# EAGLE schematic sparta_rev2 (EAGLE 6.5.0)
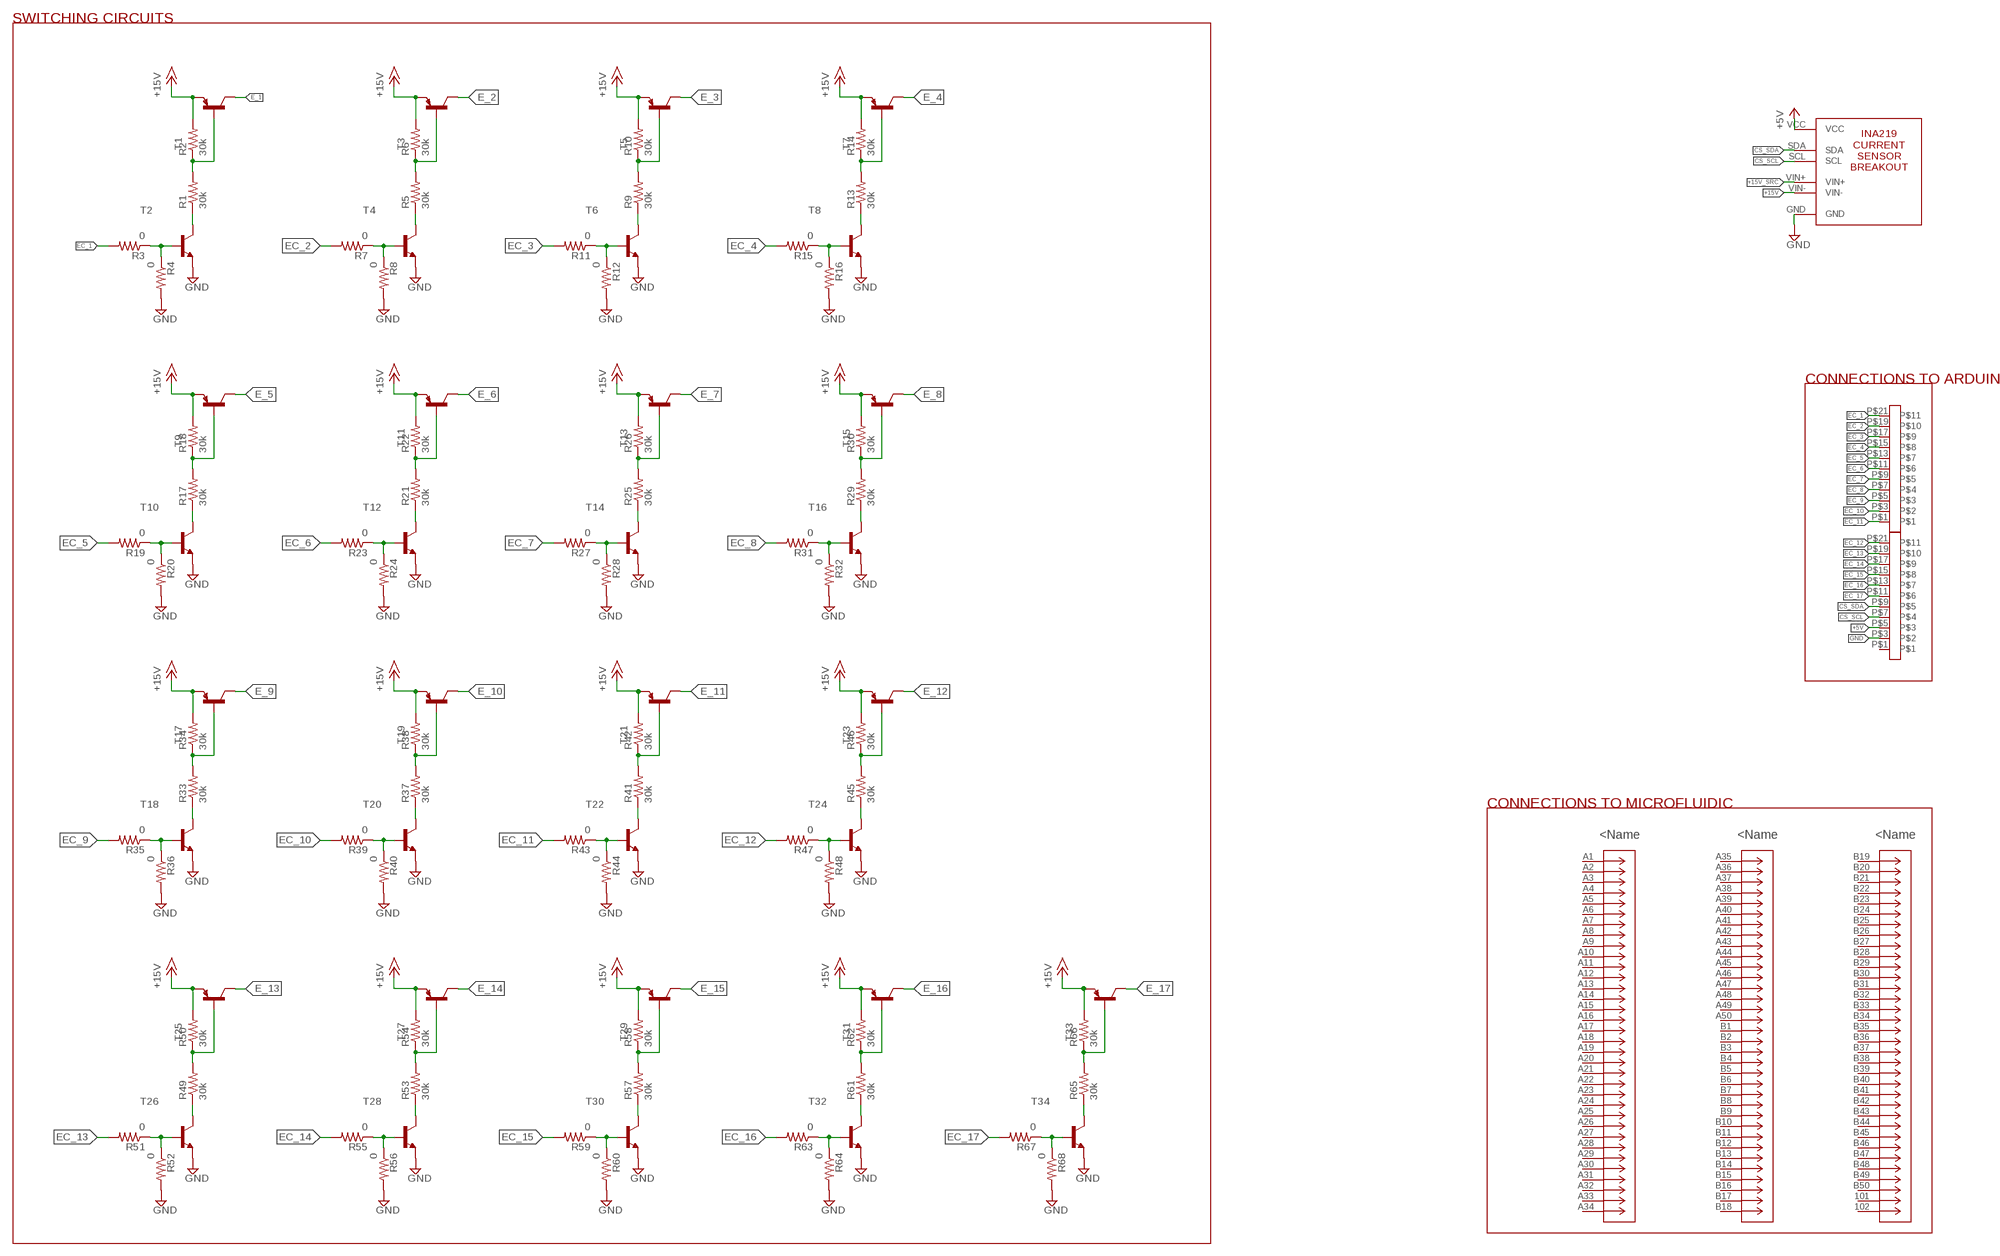
[diagram p0: schematic, sheet 1]

## Parts
J1  FX2-100P-1.27SV(71)  [CON100_2X50_UTZF_FX2C]
R1  30k  R-US_0207/10  [0207/10]
R2  30k  R-US_0207/10  [0207/10]
R3  0  R-US_0207/10  [0207/10]
R4  0  R-US_0207/10  [0207/10]
R5  30k  R-US_0207/10  [0207/10]
R6  30k  R-US_0207/10  [0207/10]
R7  0  R-US_0207/10  [0207/10]
R8  0  R-US_0207/10  [0207/10]
R9  30k  R-US_0207/10  [0207/10]
R10  30k  R-US_0207/10  [0207/10]
R11  0  R-US_0207/10  [0207/10]
R12  0  R-US_0207/10  [0207/10]
R13  30k  R-US_0207/10  [0207/10]
R14  30k  R-US_0207/10  [0207/10]
R15  0  R-US_0207/10  [0207/10]
R16  0  R-US_0207/10  [0207/10]
R17  30k  R-US_0207/10  [0207/10]
R18  30k  R-US_0207/10  [0207/10]
R19  0  R-US_0207/10  [0207/10]
R20  0  R-US_0207/10  [0207/10]
R21  30k  R-US_0207/10  [0207/10]
R22  30k  R-US_0207/10  [0207/10]
R23  0  R-US_0207/10  [0207/10]
R24  0  R-US_0207/10  [0207/10]
R25  30k  R-US_0207/10  [0207/10]
R26  30k  R-US_0207/10  [0207/10]
R27  0  R-US_0207/10  [0207/10]
R28  0  R-US_0207/10  [0207/10]
R29  30k  R-US_0207/10  [0207/10]
R30  30k  R-US_0207/10  [0207/10]
R31  0  R-US_0207/10  [0207/10]
R32  0  R-US_0207/10  [0207/10]
R33  30k  R-US_0207/10  [0207/10]
R34  30k  R-US_0207/10  [0207/10]
R35  0  R-US_0207/10  [0207/10]
R36  0  R-US_0207/10  [0207/10]
R37  30k  R-US_0207/10  [0207/10]
R38  30k  R-US_0207/10  [0207/10]
R39  0  R-US_0207/10  [0207/10]
R40  0  R-US_0207/10  [0207/10]
R41  30k  R-US_0207/10  [0207/10]
R42  30k  R-US_0207/10  [0207/10]
R43  0  R-US_0207/10  [0207/10]
R44  0  R-US_0207/10  [0207/10]
R45  30k  R-US_0207/10  [0207/10]
R46  30k  R-US_0207/10  [0207/10]
R47  0  R-US_0207/10  [0207/10]
R48  0  R-US_0207/10  [0207/10]
R49  30k  R-US_0207/10  [0207/10]
R50  30k  R-US_0207/10  [0207/10]
R51  0  R-US_0207/10  [0207/10]
R52  0  R-US_0207/10  [0207/10]
R53  30k  R-US_0207/10  [0207/10]
R54  30k  R-US_0207/10  [0207/10]
R55  0  R-US_0207/10  [0207/10]
R56  0  R-US_0207/10  [0207/10]
R57  30k  R-US_0207/10  [0207/10]
R58  30k  R-US_0207/10  [0207/10]
R59  0  R-US_0207/10  [0207/10]
R60  0  R-US_0207/10  [0207/10]
R61  30k  R-US_0207/10  [0207/10]
R62  30k  R-US_0207/10  [0207/10]
R63  0  R-US_0207/10  [0207/10]
R64  0  R-US_0207/10  [0207/10]
R65  30k  R-US_0207/10  [0207/10]
R66  30k  R-US_0207/10  [0207/10]
R67  0  R-US_0207/10  [0207/10]
R68  0  R-US_0207/10  [0207/10]
T1  -PNP-TO220V  [TO220V]
T2  -NPN-TO92-EBC  [TO92-EBC]
T3  -PNP-TO220V  [TO220V]
T4  -NPN-TO92-EBC  [TO92-EBC]
T5  -PNP-TO220V  [TO220V]
T6  -NPN-TO92-EBC  [TO92-EBC]
T7  -PNP-TO220V  [TO220V]
T8  -NPN-TO92-EBC  [TO92-EBC]
T9  -PNP-TO220V  [TO220V]
T10  -NPN-TO92-EBC  [TO92-EBC]
T11  -PNP-TO220V  [TO220V]
T12  -NPN-TO92-EBC  [TO92-EBC]
T13  -PNP-TO220V  [TO220V]
T14  -NPN-TO92-EBC  [TO92-EBC]
T15  -PNP-TO220V  [TO220V]
T16  -NPN-TO92-EBC  [TO92-EBC]
T17  -PNP-TO220V  [TO220V]
T18  -NPN-TO92-EBC  [TO92-EBC]
T19  -PNP-TO220V  [TO220V]
T20  -NPN-TO92-EBC  [TO92-EBC]
T21  -PNP-TO220V  [TO220V]
T22  -NPN-TO92-EBC  [TO92-EBC]
T23  -PNP-TO220V  [TO220V]
T24  -NPN-TO92-EBC  [TO92-EBC]
T25  -PNP-TO220V  [TO220V]
T26  -NPN-TO92-EBC  [TO92-EBC]
T27  -PNP-TO220V  [TO220V]
T28  -NPN-TO92-EBC  [TO92-EBC]
T29  -PNP-TO220V  [TO220V]
T30  -NPN-TO92-EBC  [TO92-EBC]
T31  -PNP-TO220V  [TO220V]
T32  -NPN-TO92-EBC  [TO92-EBC]
T33  -PNP-TO220V  [TO220V]
T34  -NPN-TO92-EBC  [TO92-EBC]
U$1  INA219_SIL  [INA219_SIL]
U$2  HEADERS_11  [HEADERS_11]
U$3  HEADERS_11  [HEADERS_11]

## Nets
+5V: U$1.VCC
+15V: R2.2 R6.2 R10.2 R14.2 R18.2 R22.2 R26.2 R30.2 R34.2 R38.2 R42.2 R46.2 R50.2 R54.2 R58.2 R62.2 R66.2 T1.3(E) T3.3(E) T5.3(E) T7.3(E) T9.3(E) T11.3(E) T13.3(E) T15.3(E) T17.3(E) T19.3(E) T21.3(E) T23.3(E) T25.3(E) T27.3(E) T29.3(E) T31.3(E) T33.3(E) U$1.VIN-
+15V_SRC: U$1.VIN+
CS_SCL: U$1.SCL
CS_SDA: U$1.SDA
E_1: T1.2(C)
E_2: T3.2(C)
E_3: T5.2(C)
E_4: T7.2(C)
E_5: T9.2(C)
E_6: T11.2(C)
E_7: T13.2(C)
E_8: T15.2(C)
E_9: T17.2(C)
E_10: T19.2(C)
E_11: T21.2(C)
E_12: T23.2(C)
E_13: T25.2(C)
E_14: T27.2(C)
E_15: T29.2(C)
E_16: T31.2(C)
E_17: T33.2(C)
EC_1: R3.2 U$2.P$21
EC_2: R7.2
EC_3: R11.2
EC_4: R15.2
EC_5: R19.2
EC_6: R23.2
EC_7: R27.2
EC_8: R31.2
EC_9: R35.2
EC_10: R39.2
EC_11: R43.2
EC_12: R47.2
EC_13: R51.2
EC_14: R55.2
EC_15: R59.2
EC_16: R63.2
EC_17: R67.2
GND: R4.2 R8.2 R12.2 R16.2 R20.2 R24.2 R28.2 R32.2 R36.2 R40.2 R44.2 R48.2 R52.2 R56.2 R60.2 R64.2 R68.2 T2.E T4.E T6.E T8.E T10.E T12.E T14.E T16.E T18.E T20.E T22.E T24.E T26.E T28.E T30.E T32.E T34.E U$1.GND
N$1: R3.1 R4.1 T2.B
N$2: R1.1 T2.C
N$3: R1.2 R2.1 T1.1(B)
N$4: R7.1 R8.1 T4.B
N$5: R5.1 T4.C
N$6: R5.2 R6.1 T3.1(B)
N$7: R11.1 R12.1 T6.B
N$8: R9.1 T6.C
N$9: R9.2 R10.1 T5.1(B)
N$10: R15.1 R16.1 T8.B
N$11: R13.1 T8.C
N$12: R13.2 R14.1 T7.1(B)
N$13: R19.1 R20.1 T10.B
N$14: R17.1 T10.C
N$15: R17.2 R18.1 T9.1(B)
N$16: R23.1 R24.1 T12.B
N$17: R21.1 T12.C
N$18: R21.2 R22.1 T11.1(B)
N$19: R27.1 R28.1 T14.B
N$20: R25.1 T14.C
N$21: R25.2 R26.1 T13.1(B)
N$22: R31.1 R32.1 T16.B
N$23: R29.1 T16.C
N$24: R29.2 R30.1 T15.1(B)
N$25: R35.1 R36.1 T18.B
N$26: R33.1 T18.C
N$27: R33.2 R34.1 T17.1(B)
N$28: R39.1 R40.1 T20.B
N$29: R37.1 T20.C
N$30: R37.2 R38.1 T19.1(B)
N$31: R43.1 R44.1 T22.B
N$32: R41.1 T22.C
N$33: R41.2 R42.1 T21.1(B)
N$34: R47.1 R48.1 T24.B
N$35: R45.1 T24.C
N$36: R45.2 R46.1 T23.1(B)
N$37: R51.1 R52.1 T26.B
N$38: R49.1 T26.C
N$39: R49.2 R50.1 T25.1(B)
N$40: R55.1 R56.1 T28.B
N$41: R53.1 T28.C
N$42: R53.2 R54.1 T27.1(B)
N$43: R59.1 R60.1 T30.B
N$44: R57.1 T30.C
N$45: R57.2 R58.1 T29.1(B)
N$46: R63.1 R64.1 T32.B
N$47: R61.1 T32.C
N$48: R61.2 R62.1 T31.1(B)
N$49: R67.1 R68.1 T34.B
N$50: R65.1 T34.C
N$51: R65.2 R66.1 T33.1(B)
Unconnected: J1.101(C:A33) J1.102(C:A34) J1.A1(A:A1) J1.A2(A:A2) J1.A3(A:A3) J1.A4(A:A4) J1.A5(A:A5) J1.A6(A:A6) J1.A7(A:A7) J1.A8(A:A8) J1.A9(A:A9) J1.A10(A:A10) J1.A11(A:A11) J1.A12(A:A12) J1.A13(A:A13) J1.A14(A:A14) J1.A15(A:A15) J1.A16(A:A16) J1.A17(A:A17) J1.A18(A:A18) J1.A19(A:A19) J1.A20(A:A20) J1.A21(A:A21) J1.A22(A:A22) J1.A23(A:A23) J1.A24(A:A24) J1.A25(A:A25) J1.A26(A:A26) J1.A27(A:A27) J1.A28(A:A28) J1.A29(A:A29) J1.A30(A:A30) J1.A31(A:A31) J1.A32(A:A32) J1.A33(A:A33) J1.A34(A:A34) J1.A35(B:A1) J1.A36(B:A2) J1.A37(B:A3) J1.A38(B:A4) J1.A39(B:A5) J1.A40(B:A6) J1.A41(B:A7) J1.A42(B:A8) J1.A43(B:A9) J1.A44(B:A10) J1.A45(B:A11) J1.A46(B:A12) J1.A47(B:A13) J1.A48(B:A14) J1.A49(B:A15) J1.A50(B:A16) J1.B1(B:A17) J1.B2(B:A18) J1.B3(B:A19) J1.B4(B:A20) J1.B5(B:A21) J1.B6(B:A22) J1.B7(B:A23) J1.B8(B:A24) J1.B9(B:A25) J1.B10(B:A26) J1.B11(B:A27) J1.B12(B:A28) J1.B13(B:A29) J1.B14(B:A30) J1.B15(B:A31) J1.B16(B:A32) J1.B17(B:A33) J1.B18(B:A34) J1.B19(C:A1) J1.B20(C:A2) J1.B21(C:A3) J1.B22(C:A4) J1.B23(C:A5) J1.B24(C:A6) J1.B25(C:A7) J1.B26(C:A8) J1.B27(C:A9) J1.B28(C:A10) J1.B29(C:A11) J1.B30(C:A12) J1.B31(C:A13) J1.B32(C:A14) J1.B33(C:A15) J1.B34(C:A16) J1.B35(C:A17) J1.B36(C:A18) J1.B37(C:A19) J1.B38(C:A20) J1.B39(C:A21) J1.B40(C:A22) J1.B41(C:A23) J1.B42(C:A24) J1.B43(C:A25) J1.B44(C:A26) J1.B45(C:A27) J1.B46(C:A28) J1.B47(C:A29) J1.B48(C:A30) J1.B49(C:A31) J1.B50(C:A32) U$2.P$1 U$2.P$3 U$2.P$5 U$2.P$7 U$2.P$9 U$2.P$11 U$2.P$13 U$2.P$15 U$2.P$17 U$2.P$19 U$3.P$1 U$3.P$3 U$3.P$5 U$3.P$7 U$3.P$9 U$3.P$11 U$3.P$13 U$3.P$15 U$3.P$17 U$3.P$19 U$3.P$21

## Notes on the sheet
- SWITCHING CIRCUITS
- CONNECTIONS TO ARDUINO
- CONNECTIONS TO MICROFLUIDIC

## Library data of the parts
J1 = con-hirose-FX2-100P:FX2-100P-1.27SV(71); MANUFACTURER_PART_NUMBER: FX2100P1.27SV71; VENDOR: Hirose
R1-R68 = resistor:R-US_: RESISTOR, American symbol
T1 T3 T5 T7 T9 T11 T13 T15 T17 T19 T21 T23 T25 T27 T29 T31 T33 = transistor:*-PNP-: PNP Transistror
T2 T4 T6 T8 T10 T12 T14 T16 T18 T20 T22 T24 T26 T28 T30 T32 T34 = transistor:*-NPN-: NPN Transistror BF959 corrected 2008.03.06
U$1 = my_lib:INA219_SIL
U$2 U$3 = Connectors:HEADERS_11